# EAGLE design ESP-VINDRIKTNING (EAGLE 9.6.2)
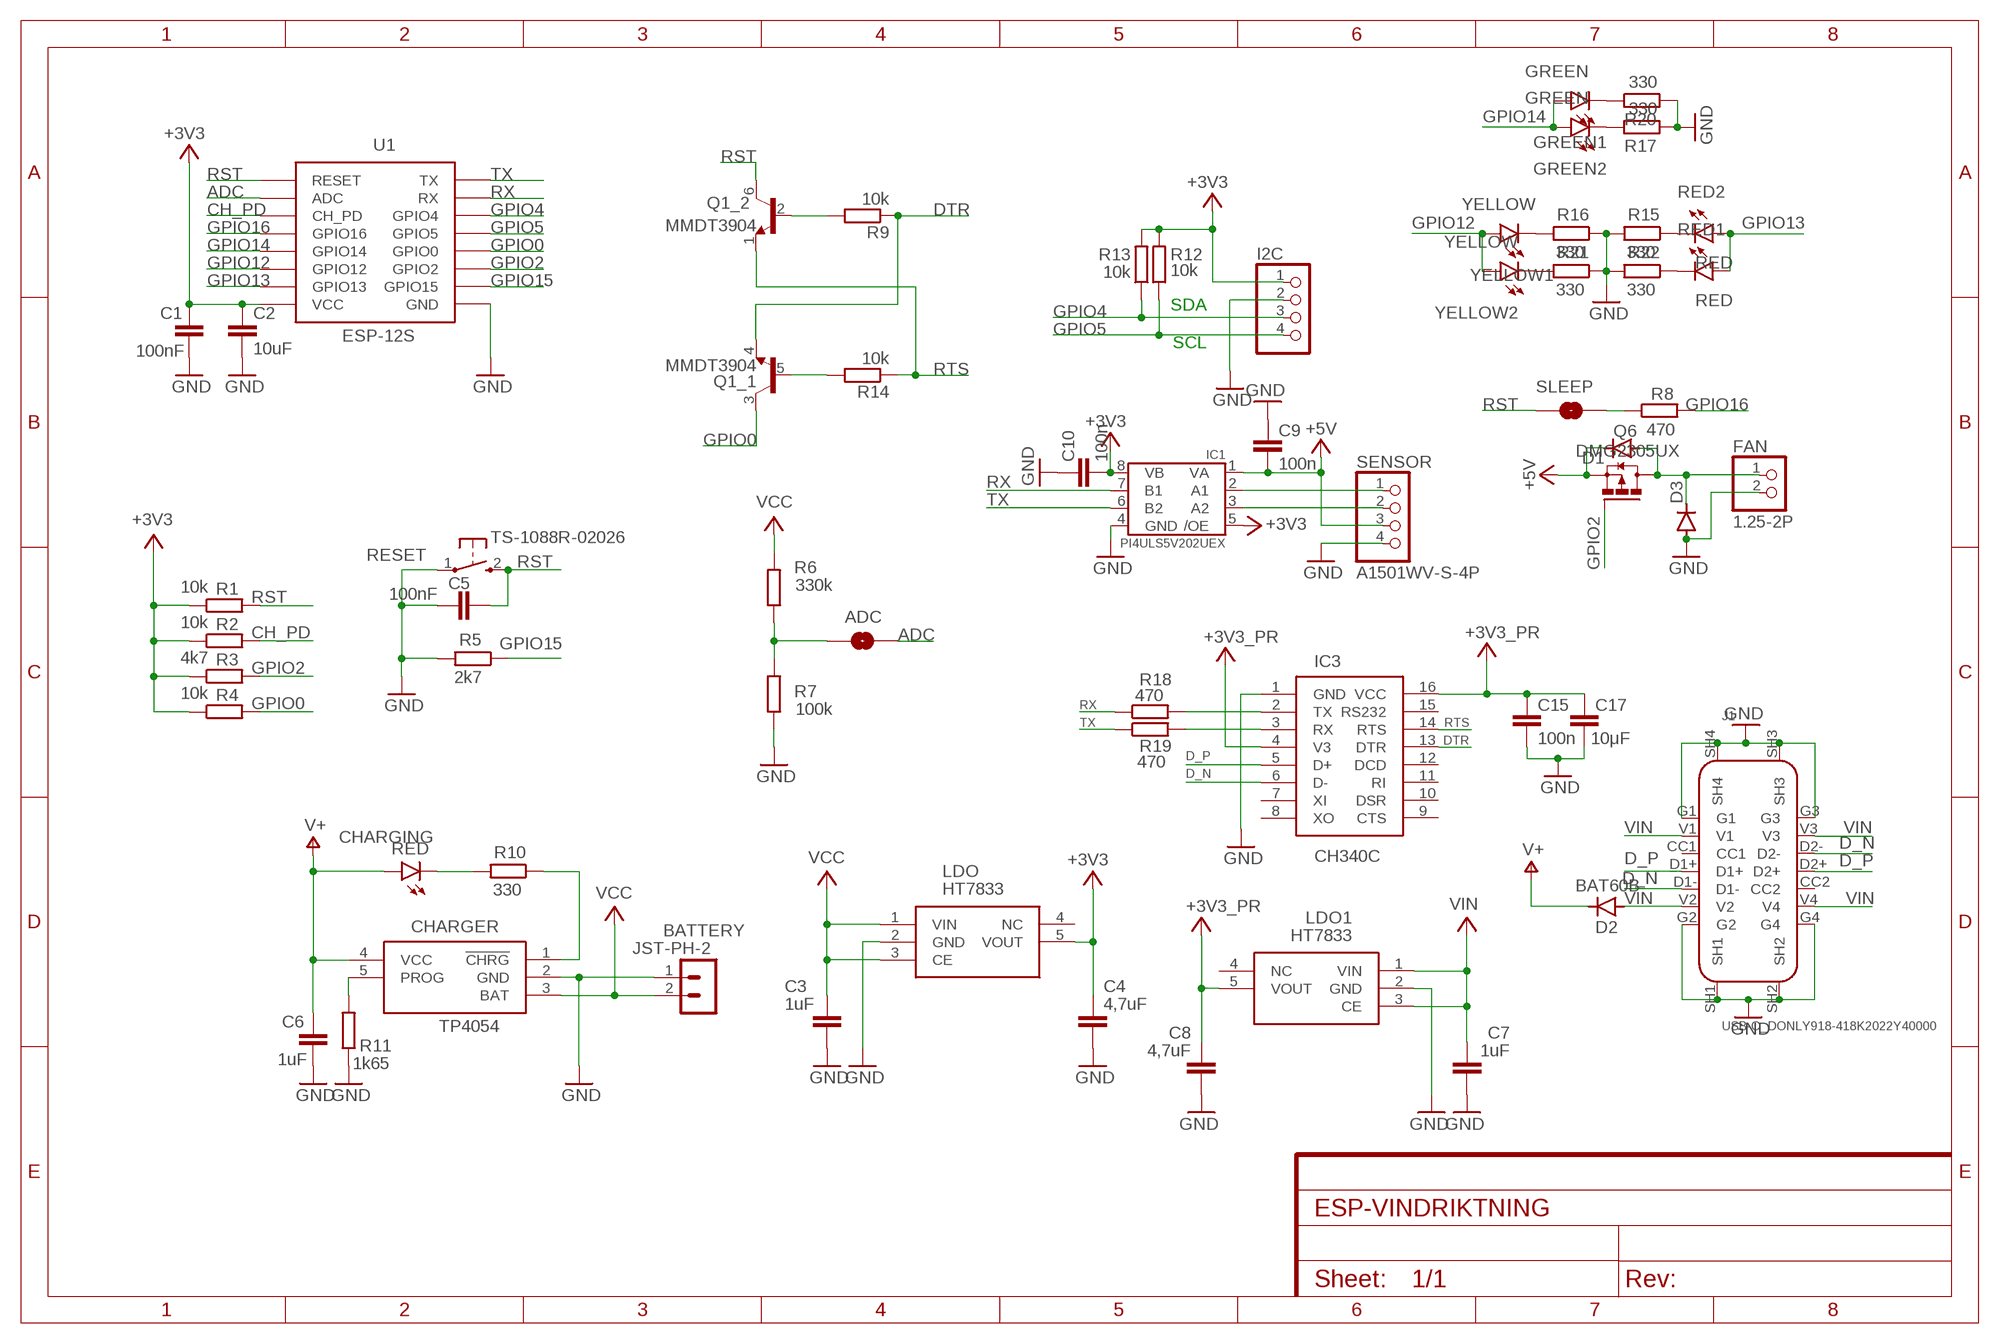
[diagram p0: schematic, sheet 1]

## Parts
ADC  JUMPER-SMT_2_NO_NO-SILK  [SMT-JUMPER_2_NO_NO-SILK]
BATTERY  JST-PH-2  [B2B-PH-K]
C1  100nF  C-EUC0603  [C0603]
C2  10uF  C-EUC0603  [C0603]
C3  1uF  C-EUC0603  [C0603]
C4  4,7uF  C-EUC0603  [C0603]
C5  100nF  C-EUC0402  [C0402]
C6  1uF  C-EUC0603  [C0603]
C7  1uF  C-EUC0603  [C0603]
C8  4,7uF  C-EUC0603  [C0603]
C9  100n  C-EUC0603  [C0603]
C10  100n  C-EUC0603  [C0603]
C15  100n  C-EUC0603  [C0603]
C17  10μF  C-EUC0603  [C0603]
CHARGER  TP4054  TP4054-42-SOT25-R  [SOT-23-5]
CHARGING  RED  LEDCHIPLED_0603  [CHIPLED_0603]
D1  DIODE-SOD323-R  [SOD323-R]
D2  BAT60B  DIODE-SOD323-R  [SOD323-R]
D3  DIODE-SOD323-R  [SOD323-R]
FAN  1.25-2P  [1.25-2P]
GREEN1  GREEN  LEDCHIP-LED0603  [CHIP-LED0603]
GREEN2  GREEN  LEDCHIP-LED0603  [CHIP-LED0603]
I2C  PINHD-1X4  [1X04]
IC1  PI4ULS5V202UEX  [MSOP8]
IC3  CH340C  USB_UART_CONVERTOR_CH340G  [SOIC16]
J1  USB-C_DONLY918-418K2022Y40000  [USB-C-TH]
LDO  HT7833  HT78XX-SOT23-5SOT23-5  [SOT23-5]
LDO1  HT7833  HT78XX-SOT23-5SOT23-5  [SOT23-5]
Q1  MMDT3904  TRANS_NPN_DUAL-MBT3904DW1T1  [SC70-6]
Q6  DMG2305UX  FDN360P  [SUPER-SOT3]
R1  10k  R-EU_R0402  [R0402]
R2  10k  R-EU_R0402  [R0402]
R3  4k7  R-EU_R0402  [R0402]
R4  10k  R-EU_R0402  [R0402]
R5  2k7  R-EU_R0402  [R0402]
R6  330k  R-EU_R0402  [R0402]
R7  100k  R-EU_R0402  [R0402]
R8  470  R-EU_R0402  [R0402]
R9  10k  R-EU_R0402  [R0402]
R10  330  R-EU_R0603  [R0603]
R11  1k65  R-EU_R0603  [R0603]
R12  10k  R-EU_R0402  [R0402]
R13  10k  R-EU_R0402  [R0402]
R14  10k  R-EU_R0402  [R0402]
R15  330  R-EU_R0402  [R0402]
R16  330  R-EU_R0402  [R0402]
R17  330  R-EU_R0402  [R0402]
R18  470  R-EU_R0603  [R0603]
R19  470  R-EU_R0603  [R0603]
R20  330  R-EU_R0402  [R0402]
R21  330  R-EU_R0402  [R0402]
R22  330  R-EU_R0402  [R0402]
RED1  RED  LEDCHIP-LED0603  [CHIP-LED0603]
RED2  RED  LEDCHIP-LED0603  [CHIP-LED0603]
RESET  TS-1088R-02026  MOMENTARY_SWITCH_TS-1088R-02026  [TS1088R02026]
SENSOR  A1501WV-S-4P  [A1501WV-S-4P]
SLEEP  JUMPER-SMT_2_NO_NO-SILK  [SMT-JUMPER_2_NO_NO-SILK]
U1  ESP-12S  WIFI_ESP12SMD  [ESP12-SMD]
YELLOW1  YELLOW  LEDCHIP-LED0603  [CHIP-LED0603]
YELLOW2  YELLOW  LEDCHIP-LED0603  [CHIP-LED0603]

## Nets
+3V3: C1.1 C2.1 C4.1 C10.2 I2C.1 IC1.5(/OE) IC1.8(VB) LDO.5(VOUT) R1.1 R2.1 R3.1 R4.1 R12.2 R13.2 U1.VCC
+3V3_PR: C8.1 C15.1 C17.1 IC3.4(V3) IC3.16(VCC) LDO1.5(VOUT)
+5V: C9.2 D1.C IC1.1(VA) Q6.2(S) SENSOR.3
ADC: ADC.2 U1.ADC
CH_PD: R2.2 U1.CH_PD
D_N: IC3.6(D-) J1.D1- J1.D2-
D_P: IC3.5(D+) J1.D1+ J1.D2+
DTR: IC3.13(DTR) Q1.4(_1:E) R9.1
GND: BATTERY.1 C1.2 C2.2 C3.2 C4.2 C5.1 C6.2 C7.2 C8.2 C9.1 C10.1 C15.2 C17.2 CHARGER.2(GND) D3.A FAN.2 I2C.2 IC1.4(GND) IC3.1(GND) J1.G1 J1.G2 J1.G3 J1.G4 J1.SH1 J1.SH2 J1.SH3 J1.SH4 LDO1.2(GND) LDO.2(GND) R5.2 R7.1 R11.1 R15.2 R16.1 R17.2 R20.2 R21.1 R22.2 RESET.1 SENSOR.4 U1.GND
GPIO0: Q1.3(_1:C) R4.2 U1.GPIO0
GPIO2: Q6.1(G) R3.2 U1.GPIO2
GPIO4: I2C.3 R13.1 U1.GPIO4
GPIO5: I2C.4 R12.1 U1.GPIO5
GPIO12: U1.GPIO12 YELLOW1.A YELLOW2.A
GPIO13: RED1.A RED2.A U1.GPIO13
GPIO14: GREEN1.A GREEN2.A U1.GPIO14
GPIO15: R5.1 U1.GPIO15
GPIO16: R8.2 U1.GPIO16
N$1: GREEN1.C R20.1
N$2: CHARGER.5(PROG) R11.2
N$3: ADC.1 R6.1 R7.2
N$4: CHARGER.1(!CHRG) R10.1
N$5: CHARGING.C R10.2
N$6: R8.1 SLEEP.2
N$8: Q1.5(_1:B) R14.2
N$11: R21.2 YELLOW2.C
N$12: Q1.2(_2:B) R9.2
N$13: R15.1 RED2.C
N$14: R16.2 YELLOW1.C
N$15: R22.1 RED1.C
N$16: GREEN2.C R17.1
N$18: D1.A D3.C FAN.1 Q6.3(D)
N$23: IC3.2(TX) R18.2
N$27: IC3.3(RX) R19.2
RST: C5.2 Q1.6(_2:C) R1.2 RESET.2 SLEEP.1 U1.RESET
RTS: IC3.14(RTS) Q1.1(_2:E) R14.1
RX: IC1.7(B1) R18.1 U1.RXD0(RX)
RX_: IC1.2(A1) SENSOR.1
TX: IC1.6(B2) R19.1 U1.TXD0(TX)
TX_: IC1.3(A2) SENSOR.2
V+: C6.1 CHARGER.4(VCC) CHARGING.A D2.C
VCC: BATTERY.2 C3.1 CHARGER.3(BAT) LDO.1(VIN) LDO.3(CE) R6.2
VIN: C7.1 D2.A J1.V1 J1.V2 J1.V3 J1.V4 LDO1.1(VIN) LDO1.3(CE)
Unconnected: IC3.7(XI) IC3.8(XO) IC3.9(CTS) IC3.10(DSR) IC3.11(RI) IC3.12(DCD) IC3.15(RS232) J1.CC1 J1.CC2 LDO1.4(NC) LDO.4(NC)

## Notes on the sheet
- SDA
- SCL

## Library data of the parts
ADC SLEEP = LasKKit-Connectors:JUMPER-SMT_2_NO: Normally open jumper This jumper has two pads in close proximity to each other. Apply solder to close the connection. Round pads are easier to solder for beginners, but are a lot larger. SparkFun Product that uses the round pads: SparkFun EL Sequencer <https://www.sparkfun.com/products/12781>
BATTERY = LasKKit-Connectors:JST-PH-2: HEADER
C1-C3 C5-C7 C9 C10 C15 C17 = rcl:C-EU: CAPACITOR, European symbol; SPICEPREFIX: C
C4 C8 = rcl:C-EU: CAPACITOR, European symbol; LCSC_PART: C50936; SPICEPREFIX: C
CHARGER = LasKKit-Power:TP4054-42-SOT25-R: Standalone Linear Li-ion Battery Charger with Thermal Regulation, SOT-23-5 Source: Datasheet <http://images.100y.com.tw/pdf_file/38-TP-TP4054x.pdf>; ARROW_PART_NUMBER: TP4054-42-SOT25-R; DESCRIPTION: Standalone Linear Li-ion Battery Charger with Thermal Regulation, SOT-23-5; HEIGHT: 1mm; MANUFACTURER_NAME: TOP POWER; MANUFACTURER_PART_NUMBER: TP4054-42-SOT25-R
CHARGING GREEN1 GREEN2 RED1 RED2 YELLOW1 YELLOW2 = led:LED: LED OSRAM: - CHIPLED LG R971, LG N971, LY N971, LG Q971, LY Q971, LO R971, LY R971 LH N974, LH R974 LS Q976, LO Q976, LY Q976 LO Q996 - Hyper CHIPLED LW Q18S LB Q993, LB Q99A, LB R99A - SideLED LS A670, LO A670, LY A670, LG A670, LP A670 LB A673, LV A673, LT A673, LW A673 LH A674 LY A675 LS A676, LA A676, LO A676, LY A676, LW A676 LS A679, LY A679, LG A679 - Hyper Micro SIDELED® LS Y876, LA Y876, LO Y876, LY Y876 LT Y87S - SmartLED LW L88C, LW L88S LB L89C, LB L89S, LG L890 LS L89K, LO L89K, LY L89K LS L896, LA L896, LO L896, LY L896 - TOPLED LS T670, LO T670, LY T670, LG T670, LP T670 LSG T670, LSP T670, LSY T670, LOP T670, LYG T670 LG T671, LOG T671, LSG T671 LB T673, LV T673, LT T673, LW T673 LH T674 LS T676, LA T676, LO T676, LY T676, LB T676, LH T676, LSB T676, LW T676 LB T67C, LV T67C, LT T67C, LS T67K, LO T67K, LY T67K, LW E67C LS E67B, LA E67B, LO E67B, LY E67B, LB E67C, LV E67C, LT E67C LW T67C LS T679, LY T679, LG T679 LS T770, LO T770, LY T770, LG T770, LP T770 LB T773, LV T773, LT T773, LW T773 LH T774 LS E675, LA E675, LY E675, LS T675 LS T776, LA T776, LO T776, LY T776, LB T776 LHGB T686 LT T68C, LB T68C - Hyper Mini TOPLED® LB M676 - Mini TOPLED Santana® LG M470 LS M47K, LO M47K, LY M47K Source: http://www.osram.convergy.de LUXEON: - LUMILED® LXK2-PW12-R00, LXK2-PW12-S00, LXK2-PW14-U00, LXK2-PW14-V00 LXK2-PM12-R00, LXK2-PM12-S00, LXK2-PM14-U00 LXK2-PE12-Q00, LXK2-PE12-R00, LXK2-PE12-S00, LXK2-PE14-T00, LXK2-PE14-U00 LXK2-PB12-K00, LXK2-PB12-L00, LXK2-PB12-M00, LXK2-PB14-N00, LXK2-PB14-P00, LXK2-PB14-Q00 LXK2-PR12-L00, LXK2-PR12-M00, LXK2-PR14-Q00, LXK2-PR14-R00 LXK2-PD12-Q00, LXK2-PD12-R00, LXK2-PD12-S00 LXK2-PH12-R00, LXK2-PH12-S00 LXK2-PL12-P00, LXK2-PL12-Q00, LXK2-PL12-R00 Source: www.luxeon.com KINGBRIGHT: KA-3528ASYC Source: www.kingbright.com
D1-D3 = diode:DIODE-: DIODE
FAN = LasKKit-Connectors:1.25; LCSC_PART: C393945
I2C = LasKKit-Connectors:PINHD-1X4: PIN HEADER
IC1 = LasKKit-IC:PI4ULS5V202UEX: 2-Bit Bi-directional Level Shifter with Automatic Sensing & Ultra Tiny Package; LCSC_PART: C481697
IC3 = LasKKit-IC:USB_UART_CONVERTOR_CH340G: Single-Chip USB to UART Bridge
J1 = LasKKit-Connectors:USB-C_DONLY; LCSC_PART: C168704
LDO LDO1 = LasKKit-Power:HT78XX-SOT23-5: Low Dropout Regulators(LDO) SOT-23-5 RoHS Source: Datasheet <https://datasheet.lcsc.com/szlcsc/1809291540_Holtek-Semicon-HT7833_C164106.pdf>
Q1 = LasKKit-Discrete:TRANS_NPN_DUAL: Dual NPN Transistors in Single Package The MBT3904W1 puts two general purpose 3904 NPN transistors in a single package. Datasheet <http://www.onsemi.com/pub_link/Collateral/MBT3904DW1T1-D.PDF> SparkFun Products: SparkFun ESP32 Thing <https://www.sparkfun.com/products/13907>; LCSC_PART: C268586; PROD_ID: TRANS-13337
Q6 = transistor-power:FDN360P: Single P-Channel, PowerTrench (R) MOSFET Source: http://www.fairchildsemi.com/ds/FD/FDN360P.pdf; LCSC_PART: C144153
R1-R22 = rcl:R-EU_: RESISTOR, European symbol; SPICEPREFIX: R
RESET = LasKKit-Switch:MOMENTARY_SWITCH_TS-1088R-02026: SMD,3x4x2.0mm Tactile Switches Source: Datasheet <https://datasheet.lcsc.com/szlcsc/1912111437_XUNPU-TS-1088R-02026_C455280.pdf>; DESCRIPTION: SMD,3x4x2.0mm Tactile Switches; HEIGHT: 2.2mm; MANUFACTURER_NAME: XUNPU; MANUFACTURER_PART_NUMBER: TS-1088R-02026
SENSOR = LasKKit-Connectors:A1501WV-S; LCSC_PART: C225162
U1 = LasKKit-Modules:WIFI_ESP12: ESP8266 Wifi module 12

## Board
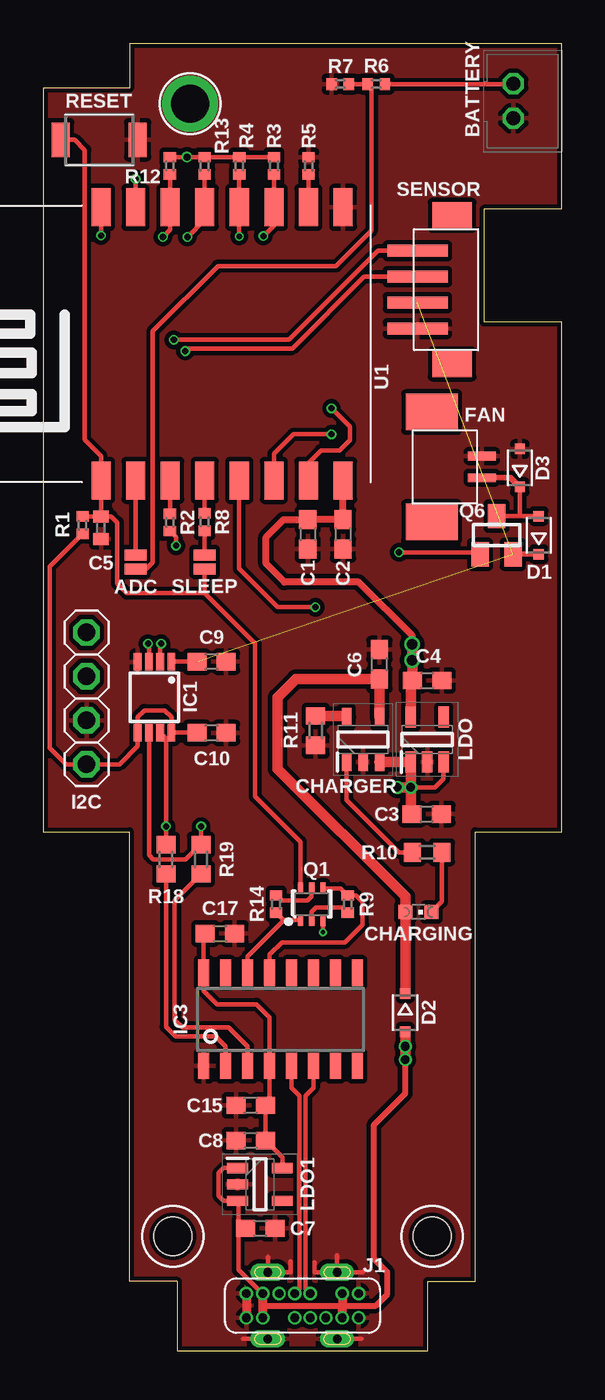
[diagram p1: board, top side]
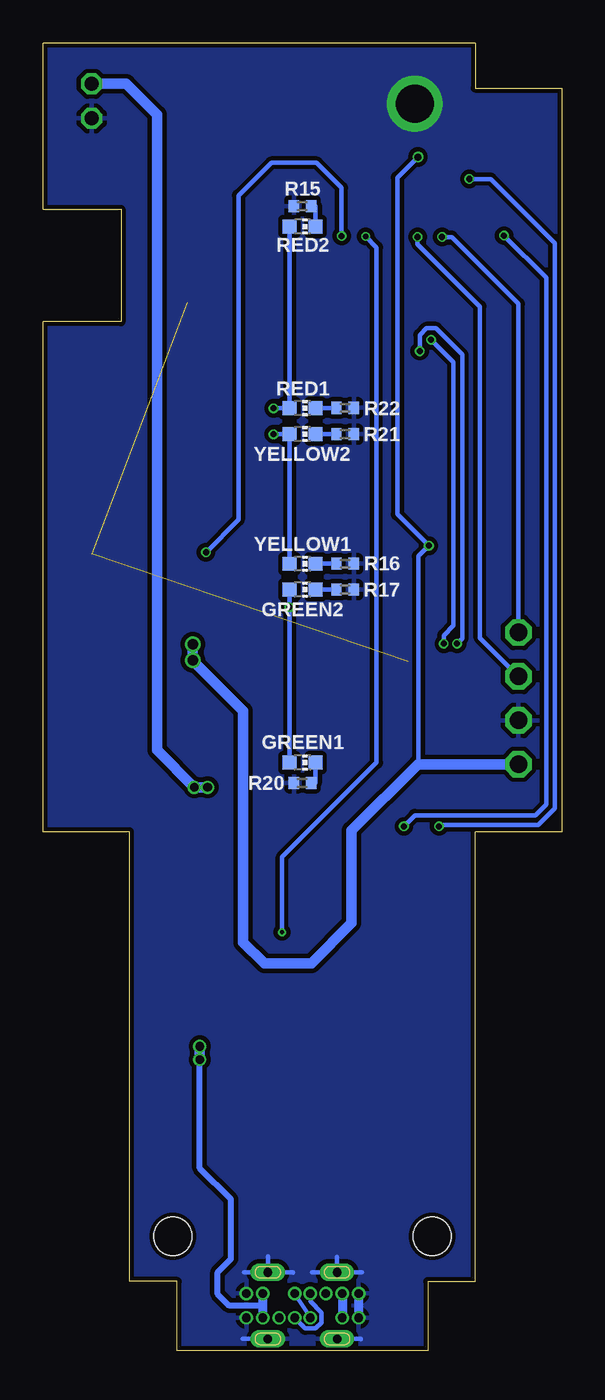
[diagram p2: board, bottom side, seen from below]

Size 30 x 75.6 mm. Coordinates in mm from the lower left corner, seen from the top.
Outline: 7.75,0 22.25,0 22.25,4 25,4 25,30 30,30 30,59.5 25.5,59.5 25.5,66 30,66 30,75.6 5,75.6 5,73 0,73 0,30 5,30 5,4 7.75,4 7.75,0
Copper layers (1*16): Top 0.035mm / dielectric 1.5mm / Bottom 0.035mm
Design rules "default *": minimum track width 6mil, minimum drill 0.2mm, track to track 4mil, track to pad 4mil, pad to pad 4mil, via to via 4mil, smd to smd 4mil, copper to edge 0.2mm, drill to drill 6mil, minimum pad ring 4mil, minimum via ring 4mil, stop-mask expansion 4mil, vias tented up to drill 25mil, thermal gap 10mil
Holes 2.2 mm at 7.5,6.6 22.5,6.6

### Footprints (pad centres in the part's own frame; a part is rotated, then mirrored left to right if it is on the bottom)
SMT-JUMPER_2_NO_NO-SILK = smd 0.635 x 1.27: 1 -0.406,0; 2 0.406,0
B2B-PH-K = drill 0.813 octagon: 1 1,0; 2 -1,0
C0603 = smd 1.1 x 1: 1 -0.85,0; 2 0.85,0
C0402 = smd 0.7 x 0.9: 1 -0.65,0; 2 0.65,0
SOT-23-5 = smd 1.05 x 0.55: 1 -1.3,0.95; 2 -1.3,0; 3 -1.3,-0.95; 4 1.3,-0.95; 5 1.3,0.95
CHIPLED_0603 = smd 0.8 x 0.8: A 0,-0.75; C 0,0.75
SOD323-R = smd 0.6 x 0.6: A 1.1,0; C -1.1,0
1.25-2P = smd 0.5 x 1.6: 1 -0.625,0; 2 0.625,0 | smd 2.1 x 3: P$3 -3.175,2.9; P$4 3.175,2.9
CHIP-LED0603 = smd 0.8 x 0.8: A 0,-0.75; C 0,0.75
1X04 = drill 1.016 octagon: 1 -3.81,0; 2 -1.27,0; 3 1.27,0; 4 3.81,0
MSOP8 = smd 0.45 x 1: 1 -0.975,-2.05; 2 -0.325,-2.05; 3 0.325,-2.05; 4 0.975,-2.05; 5 0.975,2.05; 6 0.325,2.05; 7 -0.325,2.05; 8 -0.975,2.05
SOIC16 = smd 0.635 x 1.524: 1 -4.445,-2.695; 2 -3.175,-2.695; 3 -1.905,-2.695; 4 -0.635,-2.695; 5 0.635,-2.695; 6 1.905,-2.695; 7 3.175,-2.695; 8 4.445,-2.695; 9 4.445,2.695; 10 3.175,2.695; 11 1.905,2.695; 12 0.635,2.695; 13 -0.635,2.695; 14 -1.905,2.695; 15 -3.175,2.695; 16 -4.445,2.695
USB-C-TH = drill 0.5 pad 0.76: CC1 -1.35,0.7; CC2 1.35,-0.7; D1+ -0.45,0.7; D1- 0.45,0.7; D2+ 0.45,-0.7; D2- -0.45,-0.7; G1 -3.25,0.7; G2 3.25,0.7; G3 -3.25,-0.7; G4 3.25,-0.7; V1 -2.3,0.7; V2 2.3,0.7; V3 -2.3,-0.7; V4 2.3,-0.7 | drill 0.5 pad 1 long: SH1 -2,-1.93; SH2 2,-1.93; SH3 -2,1.93; SH4 2,1.93
SOT23-5 = smd 1.2 x 0.6: 1 -1.3,0.95; 2 -1.3,0; 3 -1.3,-0.95; 4 1.3,-0.95; 5 1.3,0.95
SC70-6 = smd 0.3 x 0.66: 1 -0.65,-0.92; 2 0,-0.92; 3 0.65,-0.92; 4 0.65,0.92; 5 0,0.92; 6 -0.65,0.92
SUPER-SOT3 = smd 1 x 1.4: 1 -0.95,-1.1; 2 0.95,-1.1; 3 0,1.1
R0402 = smd 0.6 x 0.7: 1 -0.5,0; 2 0.5,0
R0603 = smd 1 x 1.1: 1 -0.85,0; 2 0.85,0
TS1088R02026 = smd 1.05 x 2: 1 -2.225,0; 2 2.225,0
A1501WV-S-4P = smd 0.7 x 3.5: 1 -2.25,0; 2 -0.75,0; 3 0.75,0; 4 2.25,0 | smd 1.5 x 2.3: P$5 -4.3,2; P$6 4.3,2
ESP12-SMD = smd 1.1 x 2.2: ADC -6.1,-7.9; CH_PD -4.1,-7.9; GND 5.9,7.9; GPIO0 -0.1,7.9; GPIO2 1.9,7.9; GPIO4 -2.1,7.9; GPIO5 -4.1,7.9; GPIO12 1.9,-7.9; GPIO13 3.9,-7.9; GPIO14 -0.1,-7.9; GPIO15 3.9,7.9; GPIO16 -2.1,-7.9; RESET -8.1,-7.9; RXD0 -6.1,7.9; TXD0 -8.1,7.9; VCC 5.9,-7.9

### Placement (x,y rotation side)
ADC  5.35,45.6 90 top
BATTERY  27.2,72.25 270 top
C1  15.3,47.2 270 top
C2  17.34,47.2 270 top
C3  22.19,31.02 0 top
C4  22.21,38.74 0 top
C5  3.34,47.58 90 top
C6  19.46,39.68 90 top
C7  12.56,7.07 0 top
C8  12,12.15 180 top
C9  9.74,39.84 180 top
C10  9.74,35.72 180 top
C15  12,14.18 180 top
C17  10.22,24.11 0 top
CHARGER  18.51,35.34 90 top
CHARGING  21.71,25.36 270 top
D1  28.67,47.15 90 top
D2  20.94,19.54 270 top
D3  27.57,51.04 90 top
FAN  25.38,51.1 90 top
GREEN1  15,34 270 bottom
GREEN2  15,44 270 bottom
I2C  2.5,37.72 90 top
IC1  6.44,37.78 180 top
IC3  13.73,19.16 0 top
J1  15,2.6 0 top
LDO  22.21,35.34 90 top
LDO1  12.54,9.61 0 top
Q1  15.53,25.82 0 top
Q6  26.23,47.15 0 top
R1  2.27,47.74 90 top
R2  7.33,47.89 90 top
R3  13.35,68.51 270 top
R4  11.34,68.51 270 top
R5  15.36,68.51 90 top
R6  19.27,73.24 0 top
R7  17.18,73.24 0 top
R8  9.34,47.91 90 top
R9  17.62,25.82 270 top
R10  22.21,28.81 0 top
R11  15.76,35.85 90 top
R12  7.33,68.51 90 top
R13  9.34,68.51 90 top
R14  13.48,25.82 90 top
R15  15,66.18 180 bottom
R16  12.54,45.5 180 bottom
R17  12.54,44 0 bottom
R18  7.1,28.41 270 top
R19  9.13,28.41 270 top
R20  15,32.83 180 bottom
R21  12.54,52.99 180 bottom
R22  12.54,54.52 0 bottom
RED1  15,54.5 270 bottom
RED2  15,65 270 bottom
RESET  3.24,70.01 180 top
SENSOR  21.65,61.35 270 top
SLEEP  9.34,45.6 90 top
U1  11.44,58.21 0 top
YELLOW1  15,45.5 270 bottom
YELLOW2  15,53 270 bottom

### Tracks (layer width: path | path; a pad name or v marks a point on that pad's centre or on a via)
+3V3  (via drill 0.35, 0.4, 0.6)
  Top 0.254: R3.1 R4.1 R13.2 v8.32,69.01 | v8.32,69.01 R12.2 | v8.32,69.02 v8.32,69.01 | R2.1 7.68,47.03 v7.68,46.54 | R1.1 0.37,45.33 0.37,34.86 1.32,33.91 I2C.1 4.42,33.91 5.46,34.95 IC1.5 5.46,36.63 5.86,37.02 7.02,37.02 7.42,36.63 IC1.8 C10.2
  Top 0.406: C2.1 C1.1 13.89,48.05 12.89,47.05 12.89,45.5 13.96,44.43 18.25,44.43 21.35,41.34 v21.35,40.85 | C2.1 U1.VCC | 17.55,48.05 C2.1
  Top 0.61: LDO.5 21.26,38.64 C4.1 21.36,39.9 v21.35,39.91 v21.35,40.85
  Bottom 0.254: 8.29,33.91 8.29,45.93 v7.68,46.54 9.51,48.37 9.51,67.83 v8.32,69.02
  Bottom 0.61: v21.35,40.85 v21.35,39.91 18.43,36.99 18.43,23.61 17.21,22.39 14.49,22.39 12.15,24.72 12.15,30.08 8.33,33.91 8.29,33.91 7.67,33.91 I2C.1
+3V3_PR
  Top 0.254: C17.1 9.29,24.02 IC3.16 9.29,20.81 10.07,20.02 12.33,20.02 13.1,19.26 IC3.4 13.1,14.43 C15.1 C8.1 13.84,11.17 LDO1.5
+5V  (2 unrouted)
  Top 0.254: IC1.1 C9.2
  Top 0.305: Q6.2 D1.C
ADC
  Top 0.254: ADC.2 U1.ADC
CH_PD
  Top 0.254: R2.2 7.33,50.3 U1.CH_PD
D_N
  Top 0.254: J1.D1- 15.18,3.57 15.18,14.74 15.63,15.2 IC3.6
  Bottom 0.254: J1.D2- J1.D1-
D_P
  Top 0.254: J1.D1+ 14.82,3.57 14.82,14.74 14.37,15.2 IC3.5
  Bottom 0.254: J1.D1+ 14.55,2.84 13.91,2.19 13.91,1.61 14.24,1.28 14.85,1.28 15.45,1.88 J1.D2+
DTR
  Top 0.254: Q1.4 17.2,26.74 R9.1 18.11,26.32 18.48,25.94 18.48,24.62 17.46,23.61 13.81,23.61 13.1,22.89 IC3.13
GND  (via drill 2.2 pad 3.2)
  Top 0.254: 12.99,5.42 13,5.42 J1.SH3 14.31,4.53 14.31,5.17 | J1.SH4 17,5.5 17.01,5.5 | J1.SH4 15.69,4.53 15.69,5.12 | J1.SH4 18.5,4.53 18.5,4.56 | J1.SH2 18.4,0.67 | 18.4,0.67 | J1.SH1 11.57,0.67 | 11.57,0.67
  Top 0.508: J1.G1 J1.G3
  Bottom 0.254: J1.SH1 11.62,0.67 11.62,0.64 | J1.SH2 18.48,0.67 | 18.48,0.67 | J1.SH4 17,5.45 16.98,5.45 | J1.SH4 18.38,4.53 | J1.SH4 15.56,4.53 15.56,4.5 | J1.SH3 14.44,4.53 | J1.SH3 13,5.42 12.99,5.42 | J1.SH3 11.57,4.53
  Bottom 0.508: J1.G1 J1.G3
  other vias: 8.5,72.1
  pour Top (isolate 0.254): 5,0 5,30 0,30 0,75.5 30,75.5 30,30 25,30 25.09,0
  pour Bottom (isolate 0.254): 5,0 5,30 0,30 0,75.5 30,75.5 30,30 25,30 25,0
GPIO0  (via drill 0.25, 0.3)
  Top 0.254: Q1.3 v16.18,24.19 | R4.2 U1.GPIO0 v11.34,64.42
  Bottom 0.254: v16.18,24.19 16.18,28.53 10.71,34.01 10.71,63.79 v11.34,64.42
GPIO2  (via drill 0.35)
  Top 0.254: R3.2 U1.GPIO2 13.34,65.05 v12.74,64.45 | v20.59,46.16 25.27,46.16 Q6.1
  Bottom 0.254: v12.74,64.45 12.74,67.24 14.19,68.69 16.8,68.69 18.71,66.79 18.71,48.04 v20.59,46.16
GPIO4  (via drill 0.35)
  Top 0.254: R13.1 U1.GPIO4 9.34,65.4 v8.34,64.4
  Bottom 0.254: v8.34,64.4 8.34,63.99 4.73,60.38 4.73,41.22 I2C.3
GPIO5  (via drill 0.35)
  Top 0.254: R12.1 7.34,68 U1.GPIO5 7.34,64.82 v6.92,64.4
  Bottom 0.254: I2C.4 2.5,60.54 6.36,64.4 v6.92,64.4
GPIO12  (via drill 0.35)
  Top 0.254: U1.GPIO12 13.34,51.86 14.47,52.99 v16.68,52.99
  Bottom 0.254: YELLOW1.A YELLOW2.A v16.68,52.99
GPIO13  (via drill 0.35)
  Top 0.254: U1.GPIO13 15.34,51.33 16.07,52.05 17.13,52.05 17.74,52.66 17.74,53.43 v16.68,54.49
  Bottom 0.254: RED2.A RED1.A v16.68,54.49
GPIO14  (via drill 0.35)
  Top 0.254: U1.GPIO14 11.34,45.21 13.57,42.99 v15.75,42.99
  Bottom 0.254: GREEN2.A v15.75,42.99 GREEN1.A
GPIO15
  Top 0.254: U1.GPIO15 15.34,68 R5.1
GPIO16
  Top 0.254: R8.2 U1.GPIO16
N$1
  Bottom 0.254: GREEN1.C 14.25,32.82 14.25,32.83 R20.1
N$2
  Top 0.61: R11.2 17.5,36.7 CHARGER.5
N$3
  Top 0.254: R7.2 R6.1 18.99,73.02 18.99,64.75 16.94,62.71 10.11,62.71 6.34,58.94 6.34,45.58 5.96,45.2 ADC.1
N$4
  Top 0.254: CHARGER.1 17.55,31.85 20.59,28.81 R10.1
N$5
  Top 0.254: CHARGING.C 23.06,25.97 R10.2
N$6
  Top 0.254: R8.1 SLEEP.2
N$8
  Top 0.254: Q1.5 15.53,26.27 15.28,26.02 13.77,26.02 R14.2
N$11
  Bottom 0.254: YELLOW2.C R21.2
N$12
  Top 0.254: Q1.2 15.53,25.36 15.79,25.61 17.32,25.61 R9.2
N$13
  Bottom 0.254: RED2.C 14.24,65.01 14.24,66.17 14.25,66.18 R15.1
N$14
  Bottom 0.254: YELLOW1.C R16.2
N$15
  Bottom 0.254: RED1.C 13.05,54.5 R22.1
N$16
  Bottom 0.254: GREEN2.C R17.1
N$18
  Top 0.254: Q6.3 27.57,48.25 | 27.57,48.25 D1.A | D3.C 27.57,48.25
  Top 0.305: FAN.1 27.03,50.48 D3.C
N$23
  Top 0.254: IC3.2 10.55,17.59 9.97,18.17 7.66,18.17 7.1,18.73 R18.2
N$27
  Top 0.254: IC3.3 11.82,17.59 10.73,18.68 8.07,18.68 7.61,19.14 7.61,26.03 R19.2
RST
  Top 0.254: Q1.6 14.88,29.41 12.26,32.04 12.26,40.88 9.34,43.8 | 9.34,43.8 SLEEP.1 | 9.34,43.8 4.84,43.8 4.28,44.36 4.28,47.89 3.93,48.24 C5.2 | RESET.2 1.82,70.01 2.4,69.43 2.4,52.68 3.34,51.74 U1.RESET C5.2 | R1.2 C5.2
RTS
  Top 0.254: Q1.1 13.93,24.9 | 13.93,24.9 13.9,24.9 R14.1 | IC3.14 11.82,22.79 13.93,24.9
RX  (via drill 0.35)
  Top 0.254: R18.1 v7.1,30.31 7.1,35.39 IC1.7 | v5.35,67.75 U1.RXD0
  Bottom 0.254: v7.1,30.31 7.02,30.39 1.36,30.39 0.39,31.35 0.39,64.04 4.1,67.75 v5.35,67.75
RX_  (via drill 0.35)
  Top 0.254: IC1.2 6.77,40.82 v6.82,40.88 | SENSOR.1 19.36,63.6 14.21,58.45 v7.56,58.45
  Bottom 0.254: v7.56,58.45 6.26,57.16 6.26,41.92 6.82,41.36 v6.82,40.88
TX  (via drill 0.35)
  Top 0.254: v9.13,30.31 R19.1 9.09,29.26 8.24,28.4 6.37,28.4 6.12,28.66 IC1.6 | v3.34,64.47 U1.TXD0
  Bottom 0.254: v9.13,30.31 8.5,30.95 1.54,30.95 0.9,31.58 0.9,62.04 v3.34,64.47
TX_  (via drill 0.35)
  Top 0.254: IC1.3 6.12,40.82 v6.06,40.88 | SENSOR.2 19.57,62.1 19.18,62.1 18.57,62.1 14.42,57.95 8.37,57.95 v8.22,57.79
  Bottom 0.254: v6.06,40.88 5.75,41.18 5.75,57.59 7.28,59.12 7.84,59.12 8.22,58.73 v8.22,57.79
V+
  Top 0.254: CHARGING.A 20.94,25.36
  Top 0.61: D2.C 20.94,25.36 20.94,26.25 13.55,33.64 13.55,37.78 14.62,38.85 19.45,38.85 C6.1 CHARGER.4
VCC  (via drill 0.5)
  Top 0.254: LDO.3 23.16,33.06 22.67,32.57 v21.26,32.57 | R6.2 27.18,73.24 BATTERY.2
  Top 0.61: v21.26,32.57 LDO.1 CHARGER.3 | v21.26,32.57 21.26,31.02 C3.1 | v20.49,32.57 v21.26,32.57
  Bottom 0.61: v20.49,32.57 v21.26,32.57 23.41,34.72 23.41,71.46 25.2,73.25 BATTERY.2
VIN  (via drill 0.5)
  Top 0.254: J1.V1 12.65,3.3 11.29,4.66 11.29,7.13 | C7.1 11.35,7.07 11.29,7.13 | LDO1.1 10.44,10.56 10.15,10.27 10.15,8.95 10.44,8.66 LDO1.3 11.29,8.66 11.29,7.13
  Top 0.356: 12.7,2.6 17.3,2.6 19.24,2.6 19.9,3.26 19.9,4.53 19.14,5.29 19.14,13.06 20.94,14.87 v20.94,17.59
  Top 0.508: J1.V2 17.3,2.6 J1.V4 | J1.V1 12.7,2.6 J1.V3
  Top 0.61: D2.A v20.94,17.59 v20.94,16.82
  Bottom 0.356: 17.3,2.6 19.24,2.6 19.9,3.26 19.9,4.53 19.14,5.29 19.14,8.75 20.94,10.55 v20.94,17.59
  Bottom 0.508: J1.V1 J1.V3 | J1.V2 17.3,2.6 J1.V4
  Bottom 0.61: v20.94,16.82 v20.94,17.59